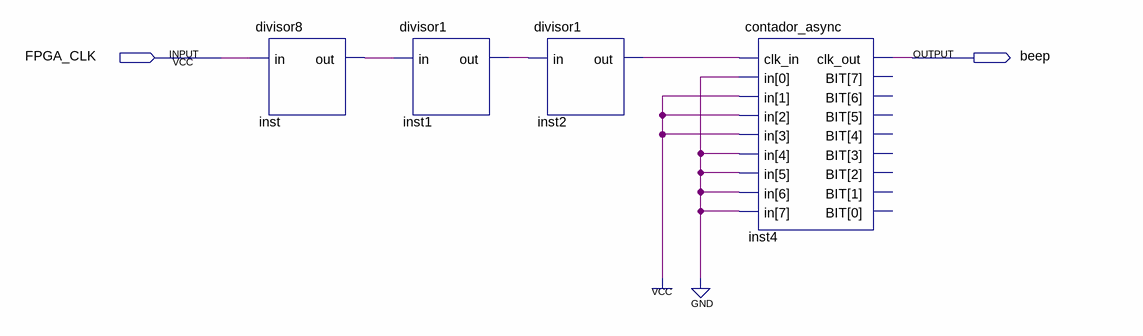
[diagram p0: schematic sheet]
// Quartus schematic buzzer_1760hz.bdf as structural Verilog: 4 symbols, 2 pins
module buzzer_1760hz (
  input  FPGA_CLK,
  output beep
);

  wire inst1_out, inst2_out, inst_out;

  divisor8 inst (.in(FPGA_CLK), .out(inst_out));
  divisor1 inst1 (.in(inst_out), .out(inst1_out));
  divisor1 inst2 (.in(inst1_out), .out(inst2_out));
  contador_async inst4 (.clk_in(inst2_out), .in(8'b00001110), .clk_out(beep));  // open: BIT
endmodule
